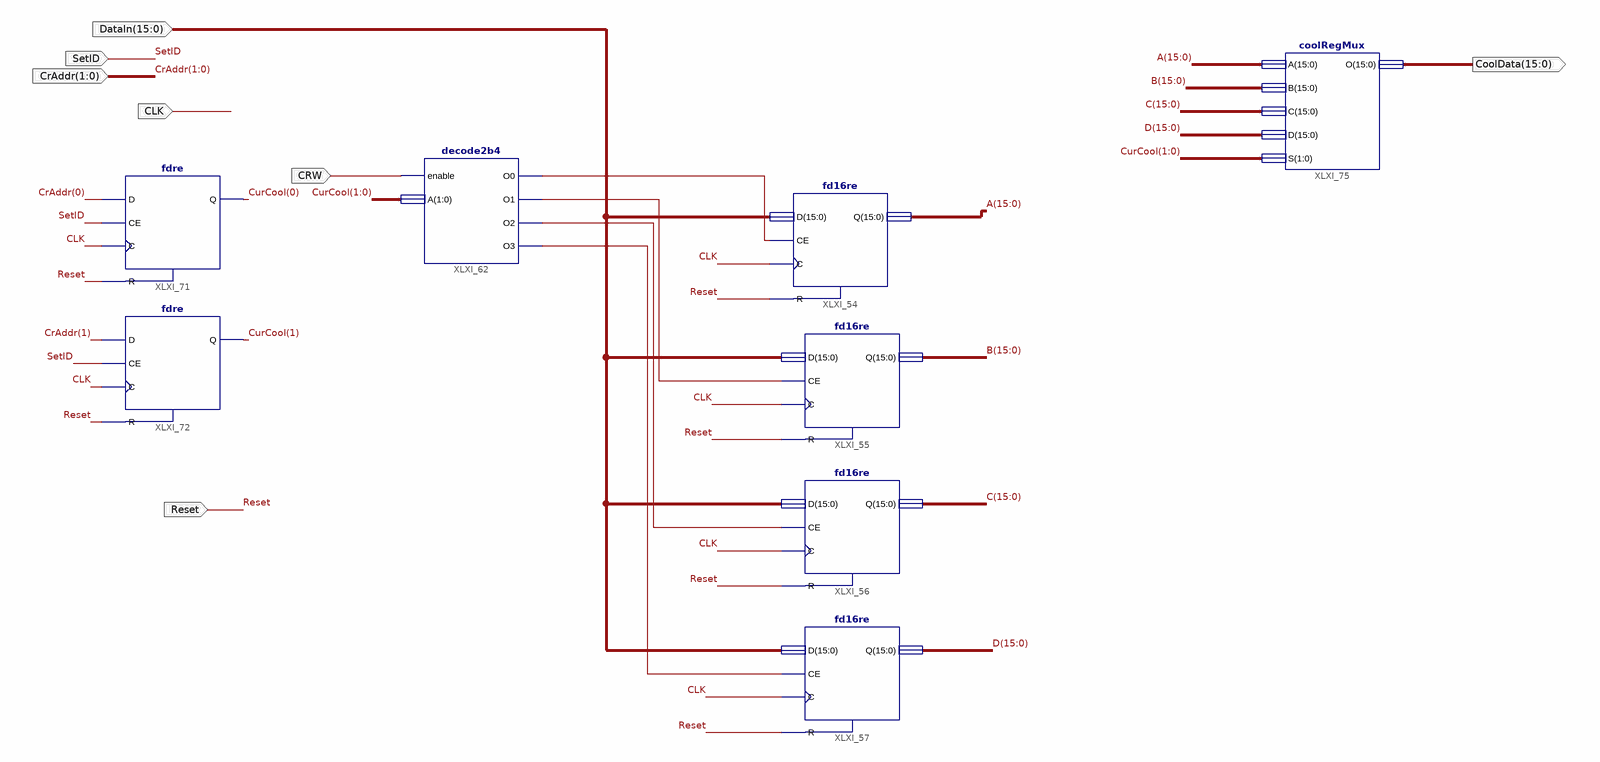
[diagram p0: schematic sheet 1]
// Xilinx ISE schematic coolRegFile.sch (spartan3a) as structural Verilog: 8 symbols, 7 ports
module coolRegFile (
  input  Reset,
  input  CLK,
  input  [15:0] DataIn,
  input  CRW,
  input  [1:0] CrAddr,
  input  SetID,
  output [15:0] CoolData
);

  wire XLXN_143, XLXN_145, XLXN_146, XLXN_148;
  wire [1:0] CurCool;
  wire [15:0] A, B, C, D;

  fd16re XLXI_54 (.C(CLK), .CE(XLXN_143), .D(DataIn), .R(Reset), .Q(A));
  fd16re XLXI_55 (.C(CLK), .CE(XLXN_145), .D(DataIn), .R(Reset), .Q(B));
  fd16re XLXI_56 (.C(CLK), .CE(XLXN_146), .D(DataIn), .R(Reset), .Q(C));
  fd16re XLXI_57 (.C(CLK), .CE(XLXN_148), .D(DataIn), .R(Reset), .Q(D));
  decode2b4 XLXI_62 (.A(CurCool), .enable(CRW), .O0(XLXN_143), .O1(XLXN_145), .O2(XLXN_146), .O3(XLXN_148));
  fdre XLXI_71 (.C(CLK), .CE(SetID), .D(CrAddr[0]), .R(Reset), .Q(CurCool[0]));
  fdre XLXI_72 (.C(CLK), .CE(SetID), .D(CrAddr[1]), .R(Reset), .Q(CurCool[1]));
  coolRegMux XLXI_75 (.A(A), .B(B), .C(C), .D(D), .S(CurCool), .O(CoolData));
endmodule
